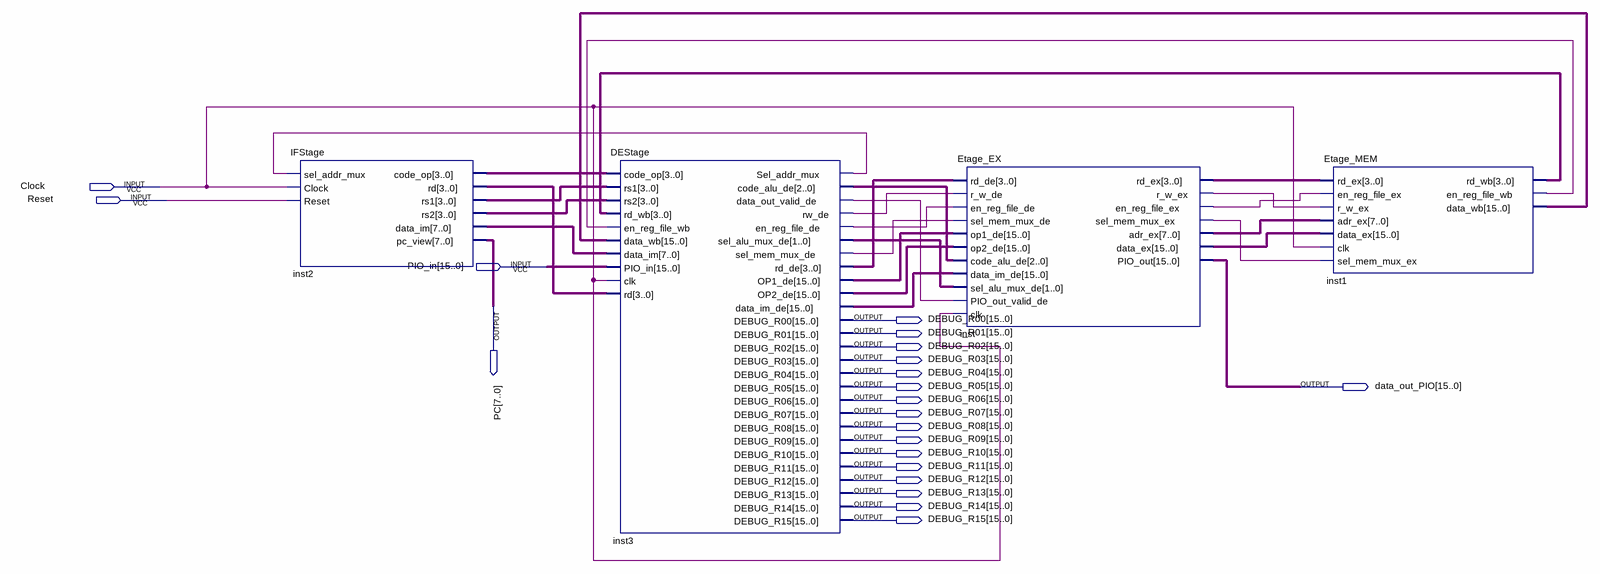
[diagram p0: schematic sheet]
// Quartus schematic RP2Processor.bdf as structural Verilog: 4 symbols, 21 pins
module RP2Processor (
  input  Clock,
  input  Reset,
  input  [15:0] PIO_in,
  output [7:0] PC,
  output [15:0] DEBUG_R00,
  output [15:0] DEBUG_R01,
  output [15:0] DEBUG_R02,
  output [15:0] DEBUG_R03,
  output [15:0] DEBUG_R04,
  output [15:0] DEBUG_R05,
  output [15:0] data_out_PIO,
  output [15:0] DEBUG_R06,
  output [15:0] DEBUG_R07,
  output [15:0] DEBUG_R08,
  output [15:0] DEBUG_R09,
  output [15:0] DEBUG_R10,
  output [15:0] DEBUG_R11,
  output [15:0] DEBUG_R12,
  output [15:0] DEBUG_R13,
  output [15:0] DEBUG_R14,
  output [15:0] DEBUG_R15
);

  wire inst1_en_reg_file_wb, inst3_data_out_valid_de, inst3_en_reg_file_de, inst3_rw_de, inst3_sel_addr_mux,
       inst3_sel_mem_mux_de, inst_en_reg_file_ex, inst_r_w_ex, inst_sel_mem_mux_ex;
  wire [1:0] inst3_sel_alu_mux_de;
  wire [2:0] inst3_code_alu_de;
  wire [3:0] inst1_rd_wb, inst2_code_op, inst2_rd, inst2_rs1, inst2_rs2, inst3_rd_de, inst_rd_ex;
  wire [7:0] inst2_data_im, inst_adr_ex;
  wire [15:0] inst1_data_wb, inst3_data_im_de, inst3_op1_de, inst3_op2_de, inst_data_ex;

  IFStage inst2 (
    .sel_addr_mux(inst3_sel_addr_mux), .Clock(Clock), .Reset(Reset), .code_op(inst2_code_op), .rd(inst2_rd),
    .rs1(inst2_rs1), .rs2(inst2_rs2), .data_im(inst2_data_im), .pc_view(PC));
  DEStage inst3 (
    .code_op(inst2_code_op), .rs1(inst2_rs1), .rs2(inst2_rs2), .rd_wb(inst1_rd_wb),
    .en_reg_file_wb(inst1_en_reg_file_wb), .data_wb(inst1_data_wb), .data_im(inst2_data_im), .PIO_in(PIO_in),
    .clk(Clock), .rd(inst2_rd), .Sel_addr_mux(inst3_sel_addr_mux), .code_alu_de(inst3_code_alu_de),
    .data_out_valid_de(inst3_data_out_valid_de), .rw_de(inst3_rw_de), .en_reg_file_de(inst3_en_reg_file_de),
    .sel_alu_mux_de(inst3_sel_alu_mux_de), .sel_mem_mux_de(inst3_sel_mem_mux_de), .rd_de(inst3_rd_de),
    .OP1_de(inst3_op1_de), .OP2_de(inst3_op2_de), .data_im_de(inst3_data_im_de), .DEBUG_R00(DEBUG_R00),
    .DEBUG_R01(DEBUG_R01), .DEBUG_R02(DEBUG_R02), .DEBUG_R03(DEBUG_R03), .DEBUG_R04(DEBUG_R04),
    .DEBUG_R05(DEBUG_R05), .DEBUG_R06(DEBUG_R06), .DEBUG_R07(DEBUG_R07), .DEBUG_R08(DEBUG_R08),
    .DEBUG_R09(DEBUG_R09), .DEBUG_R10(DEBUG_R10), .DEBUG_R11(DEBUG_R11), .DEBUG_R12(DEBUG_R12),
    .DEBUG_R13(DEBUG_R13), .DEBUG_R14(DEBUG_R14), .DEBUG_R15(DEBUG_R15));
  Etage_EX inst (
    .rd_de(inst3_rd_de), .r_w_de(inst3_rw_de), .en_reg_file_de(inst3_en_reg_file_de),
    .sel_mem_mux_de(inst3_sel_mem_mux_de), .op1_de(inst3_op1_de), .op2_de(inst3_op2_de),
    .code_alu_de(inst3_code_alu_de), .data_im_de(inst3_data_im_de), .sel_alu_mux_de(inst3_sel_alu_mux_de),
    .PIO_out_valid_de(inst3_data_out_valid_de), .clk(Clock), .rd_ex(inst_rd_ex), .r_w_ex(inst_r_w_ex),
    .en_reg_file_ex(inst_en_reg_file_ex), .sel_mem_mux_ex(inst_sel_mem_mux_ex), .adr_ex(inst_adr_ex),
    .data_ex(inst_data_ex), .PIO_out(data_out_PIO));
  Etage_MEM inst1 (
    .rd_ex(inst_rd_ex), .en_reg_file_ex(inst_en_reg_file_ex), .r_w_ex(inst_r_w_ex), .adr_ex(inst_adr_ex),
    .data_ex(inst_data_ex), .clk(Clock), .sel_mem_mux_ex(inst_sel_mem_mux_ex), .rd_wb(inst1_rd_wb),
    .en_reg_file_wb(inst1_en_reg_file_wb), .data_wb(inst1_data_wb));
endmodule
